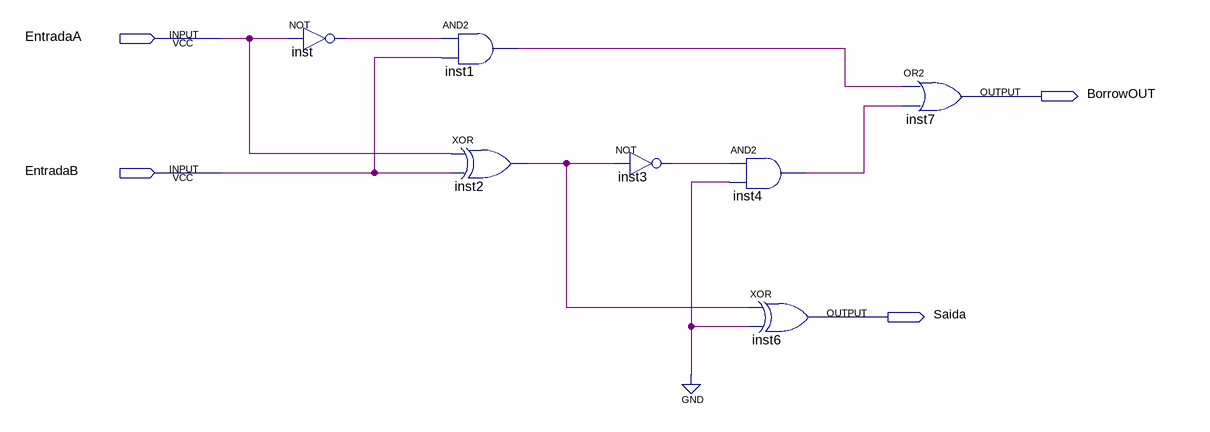
[diagram p0: schematic sheet]
// Quartus schematic SubGND.bdf as structural Verilog: 7 symbols, 4 pins
module SubGND (
  input  EntradaA,
  input  EntradaB,
  output BorrowOUT,
  output Saida
);

  wire inst1_out, inst2_out, inst3_out, inst4_out, inst_out;

  not inst (inst_out, EntradaA);
  and inst1 (inst1_out, inst_out, EntradaB);
  xor inst2 (inst2_out, EntradaA, EntradaB);
  not inst3 (inst3_out, inst2_out);
  and inst4 (inst4_out, inst3_out, 1'b0);
  xor inst6 (Saida, inst2_out, 1'b0);
  or inst7 (BorrowOUT, inst1_out, inst4_out);
endmodule
